# EAGLE design Sensor (EAGLE 9.6.0)
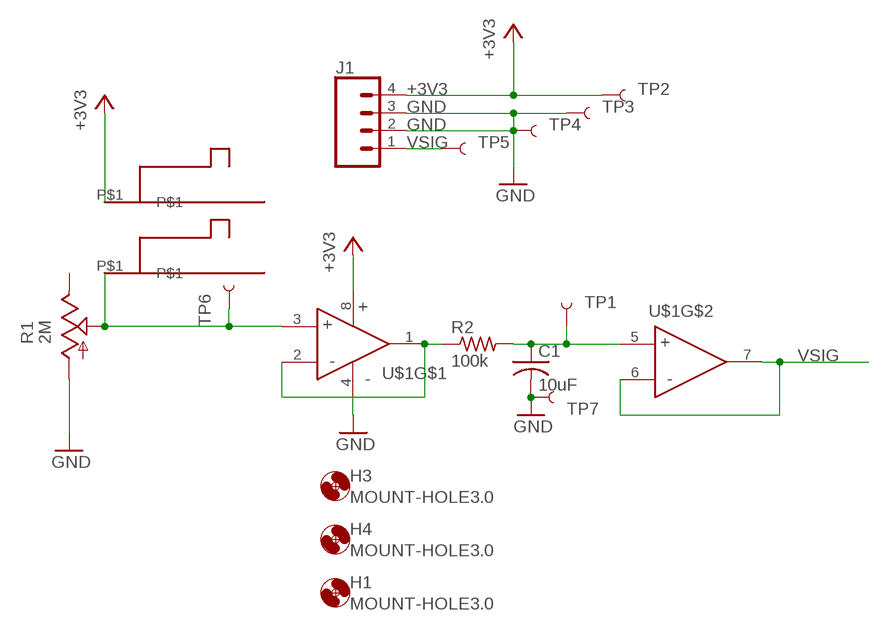
[diagram p0: schematic, sheet 1]

## Parts
C1  10uF  C-USC1206  [C1206]
H1  MOUNT-HOLE3.0  [3,0]
H3  MOUNT-HOLE3.0  [3,0]
H4  MOUNT-HOLE3.0  [3,0]
J1  CONN_04SCREW  [SCREWTERMINAL-3.5MM-4]
R1  2M  TRIM_US-CT6  [CT6]
R2  100k  R-US_R1206  [R1206]
TP1  TEST-POINT3X5  [PAD.03X.05]
TP2  TEST-POINT3X5  [PAD.03X.05]
TP3  TEST-POINT3X5  [PAD.03X.05]
TP4  TEST-POINT3X5  [PAD.03X.05]
TP5  TEST-POINT3X5  [PAD.03X.05]
TP6  TEST-POINT3X5  [PAD.03X.05]
TP7  TEST-POINT3X5  [PAD.03X.05]
U$1  TLV9102  [SOIC-8]
U$2  709155001610004  [709155001610004]
U$3  709155001610004  [709155001610004]

## Nets
+3V3: J1.4 TP2.P$1 U$1.8(V+) U$2.P$1
GND: C1.2 J1.2 J1.3 R1.A TP3.P$1 TP4.P$1 TP7.P$1 U$1.4(V-)
N$1: C1.1 R2.2 TP1.P$1 U$1.5(+)
N$2: R1.S TP6.P$1 U$1.3(NONINVERTING) U$3.P$1
N$3: R2.1 U$1.1(OUT) U$1.2(INVERTING)
VSIG: J1.1 TP5.P$1 U$1.6(-) U$1.7(OUT)
Unconnected: R1.E

## Library data of the parts
C1 = rcl:C-US: CAPACITOR, American symbol; SPICEPREFIX: C
H1 H3 H4 = holes:MOUNT-HOLE: MOUNTING HOLE with drill center marker
J1 = SparkFun-Connectors:CONN_04: Multi connection point. Often used as Generic Header-pin footprint for 0.1 inch spaced/style header connections On any of the 0.1 inch spaced packages, you can populate with these: Break Away Headers - Straight <https://www.sparkfun.com/products/116> (PRT-00116) Break Away Male Headers - Right Angle <https://www.sparkfun.com/products/553> (PRT-00553) Female Headers <https://www.sparkfun.com/products/115> (PRT-00115) Break Away Headers - Machine Pin <https://www.sparkfun.com/products/117> (PRT-00117) Break Away Female Headers - Swiss Machine Pin <https://www.sparkfun.com/products/743> (PRT-00743) For SCREWTERMINALS and SPRING TERMINALS visit here: Screw Terimnals on SparkFun.com <https://www.sparkfun.com/search/results?term=Screw+Terminals> (5mm/3.5mm/2.54mm spacing) This device is also useful as a general connection point to wire up your design to another part of your project. Our various solder wires solder well into these plated through hole pads. Hook-Up Wire - Assortment (Stranded, 22 AWG) <https://www.sparkfun.com/products/11375> (PRT-11375) Hook-Up Wire - Assortment (Solid Core, 22 AWG) <https://www.sparkfun.com/products/11367> (PRT-11367) View the entire wire category on our website here <https://www.sparkfun.com/categories/141> Special notes: Molex polarized connector foot print use with SKU : PRT-08231 with associated crimp pins and housings. 1MM SMD Version SKU: PRT-10208; PROD_ID: 2xCONN-08399; SF_ID: 2xPRT-08084
R1 = pot:TRIM_US-: POTENTIOMETER
R2 = rcl:R-US_: RESISTOR, American symbol; SPICEPREFIX: R
TP1-TP7 = SparkFun-Connectors:TEST-POINT: SparkFun Test Points Bare copper test points for troubleshooting or In-Circuit-Testing. These are used by our Production team for verifying production board runs using pogo-pins on test beds. SparkFun Products: SparkFun LSM9DS1 Breakout <https://www.sparkfun.com/products/13284> SparkFun PSOC <https://www.sparkfun.com/products/13714> SparkFun Load Cell Amplifier <https://www.sparkfun.com/products/13879>
U$1 = FormE:TLV9102
U$2 U$3 = FormE:709155001610004

## Board
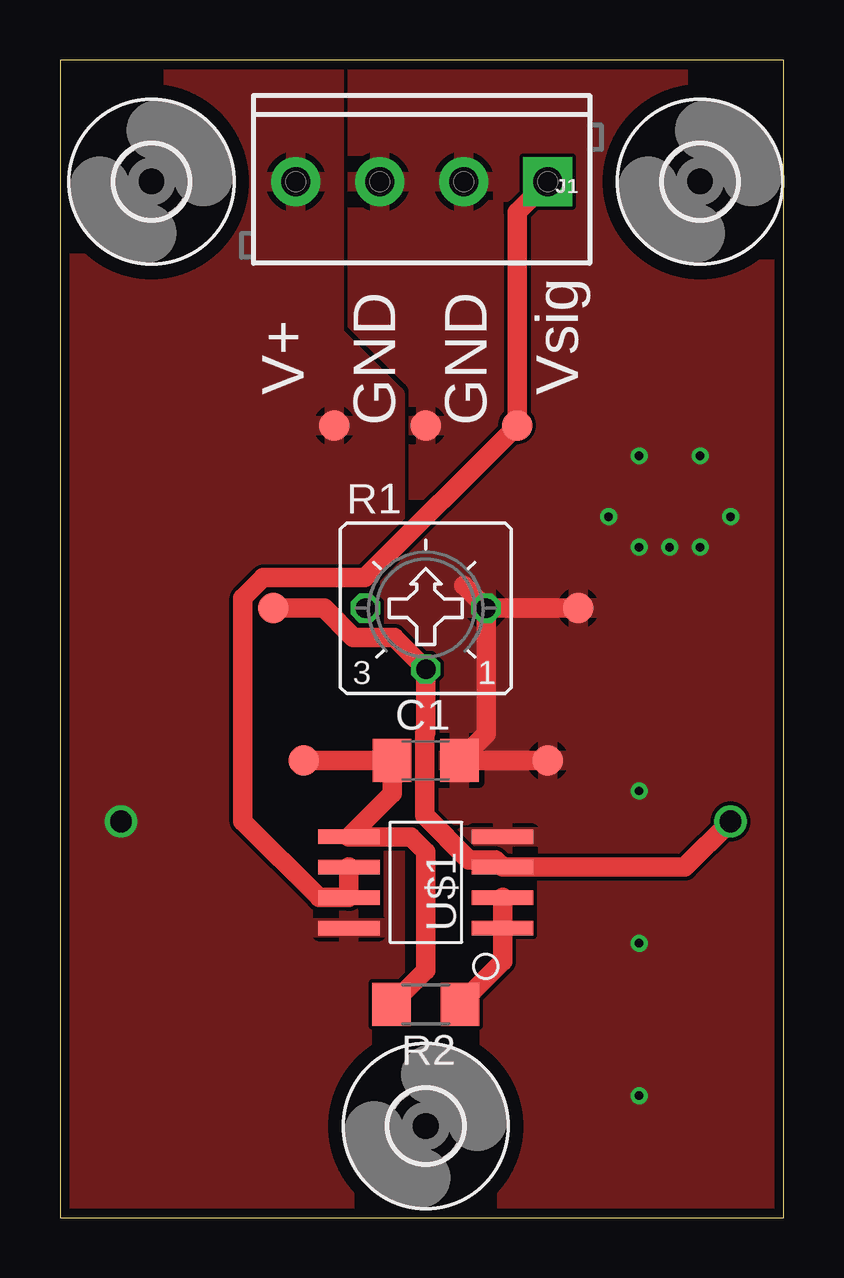
[diagram p1: board, top side]
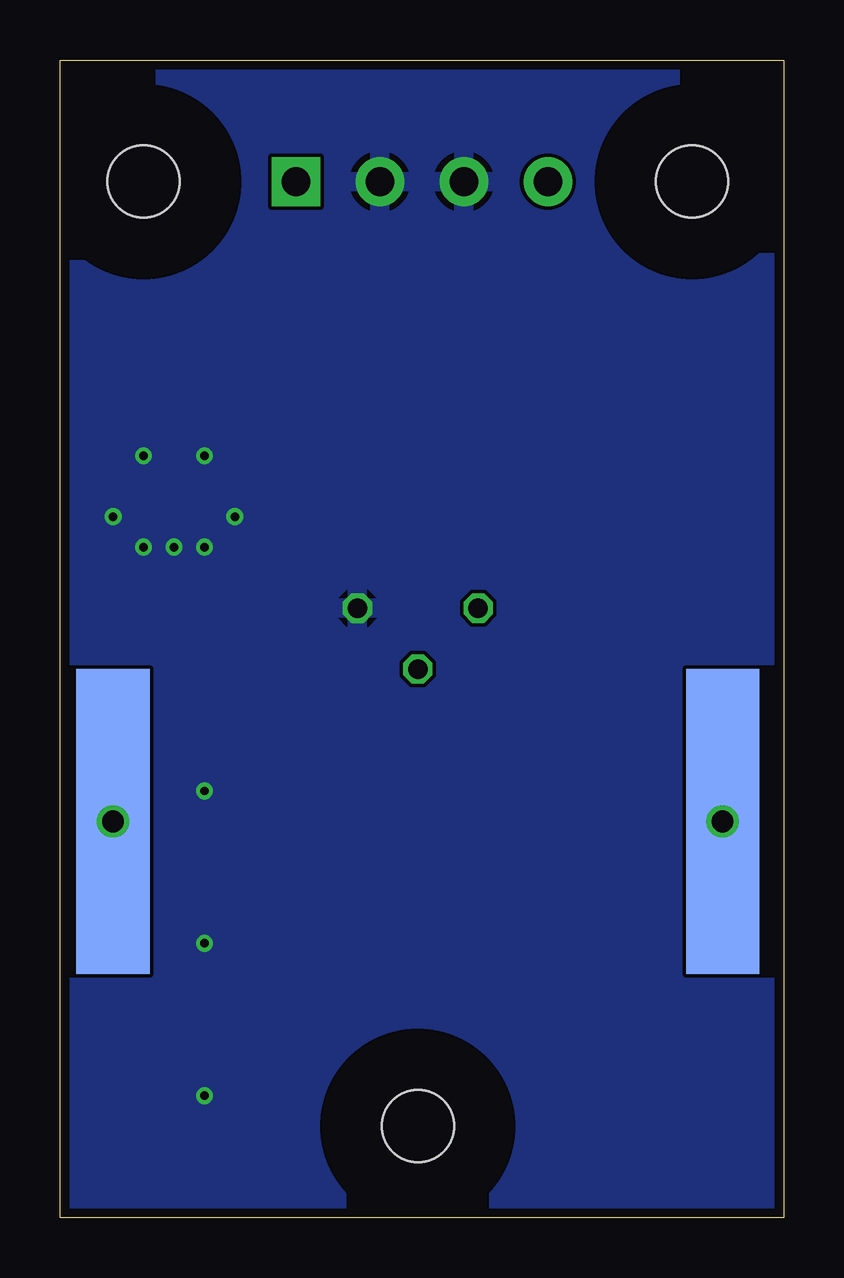
[diagram p2: board, bottom side, seen from below]

Size 30.15 x 48.25 mm. Coordinates in mm from the lower left corner, seen from the top.
Outline: 0,0 30.15,0 30.15,48.25 0,48.25 0,0
Copper layers (1*16): Top 0.0356mm / dielectric 1.5011mm / Bottom 0.0356mm
Design rules "OSH_PCB Rules": minimum track width 6mil, minimum drill 13mil, track to track 6mil, track to pad 6mil, pad to pad 6mil, via to via 6mil, smd to smd 6mil, copper to edge 15mil, drill to drill 6mil, minimum pad ring 7mil, minimum via ring 7mil, stop-mask expansion 3mil, vias tented up to drill 0mil, thermal gap 10mil

### Footprints (pad centres in the part's own frame; a part is rotated, then mirrored left to right if it is on the bottom)
C1206 = smd 1.6 x 1.8: 1 -1.4,0; 2 1.4,0
3,0 = hole 3: 0,0
SCREWTERMINAL-3.5MM-4 = drill 1.2 pad 2.032 square: 1 0,0 | drill 1.2 pad 2.032: 2 3.5,0; 3 7,0; 4 10.5,0
CT6 = drill 0.813 octagon: A 2.515,0; E -2.515,0; S 0,-2.54
R1206 = smd 1.6 x 1.803: 1 -1.422,0; 2 1.422,0
PAD.03X.05 = smd 1.27 x 1.27: P$1 0,0
SOIC-8 = smd 0.6 x 2.55: 1 -1.905,-3.2; 2 -0.635,-3.2; 3 0.635,-3.2; 4 1.905,-3.2; 5 1.905,3.2; 6 0.635,3.2; 7 -0.635,3.2; 8 -1.905,3.2
709155001610004 = smd 3.048 x 12.7: P$1 0,0

### Placement (x,y rotation side)
C1  15.24,19.05 0 top
H1  3.81,43.18 0 top
H3  15.24,3.81 0 top
H4  26.67,43.18 0 top
J1  20.32,43.18 180 top
R1  15.24,25.4 0 top
R2  15.24,8.89 180 top
TP1  10.16,19.05 0 top
TP2  11.43,33.02 0 top
TP3  21.59,25.4 0 top
TP4  15.24,33.02 0 top
TP5  19.05,33.02 0 top
TP6  8.89,25.4 0 top
TP7  20.32,19.05 0 top
U$1  15.24,13.97 90 top
U$2  2.54,16.51 0 bottom
U$3  27.94,16.51 0 bottom

### Tracks (layer width: path | path; a pad name or v marks a point on that pad's centre or on a via)
+3V3  (via drill 0.9)
  other vias: 2.54,16.51
  pour Top: 13.97,0 0,0 0,48.26 11.43,48.26 11.43,36.83 13.97,34.29
GND  (via drill 0.35)
  Top 0.813: 16.82,26.34 R1.A | TP3.P$1 R1.A | R1.A 17.75,20.16 C1.2 TP7.P$1
  other vias: 24.13,5.08 24.13,31.75 26.67,31.75 27.94,29.21 26.67,27.94 25.4,27.94 24.13,27.94 22.86,29.21 24.13,17.78 24.13,11.43
  pour Top (rank 2): 0,0 0,48.26 30.48,48.26 30.48,0
  pour Bottom: 0,48.26 30.48,48.26 30.48,0 0,0
N$1
  Top 0.813: TP1.P$1 C1.1 13.84,17.68 U$1.5 14.61,15.88 15.24,15.24 15.24,10.31 R2.2
N$2  (via drill 0.9)
  Top 0.813: TP6.P$1 11,25.4 12.22,24.18 13.92,24.18 R1.S 15.24,20.22 15.2,20.18 15.2,16.75 17.04,14.91 18.14,14.91 U$1.3 26.04,14.61 U$3.P$1
  other vias: 27.94,16.51
N$3
  Top 0.813: R2.1 18.44,10.67 U$1.1 U$1.2
VSIG
  Top 0.813: J1.1 19.05,41.91 TP5.P$1 12.7,26.67 8.47,26.67 7.62,25.82 7.62,16.51 10.79,13.34 U$1.7 U$1.6

### Text on the board
tSilk: V+ | Vsig | GND | GND